# Altium schematic sheet Connectors.SchDoc: Connectors
size A4; DrawnBy: Jarod Krane; Organization: Altium Limited; Address1: L3, 12a Rodborough Rd; Address2: Frenchs Forest; Address3: NSW; Address4: Australia 2086; Revision: 0; SheetNumber: 8; SheetTotal: 11
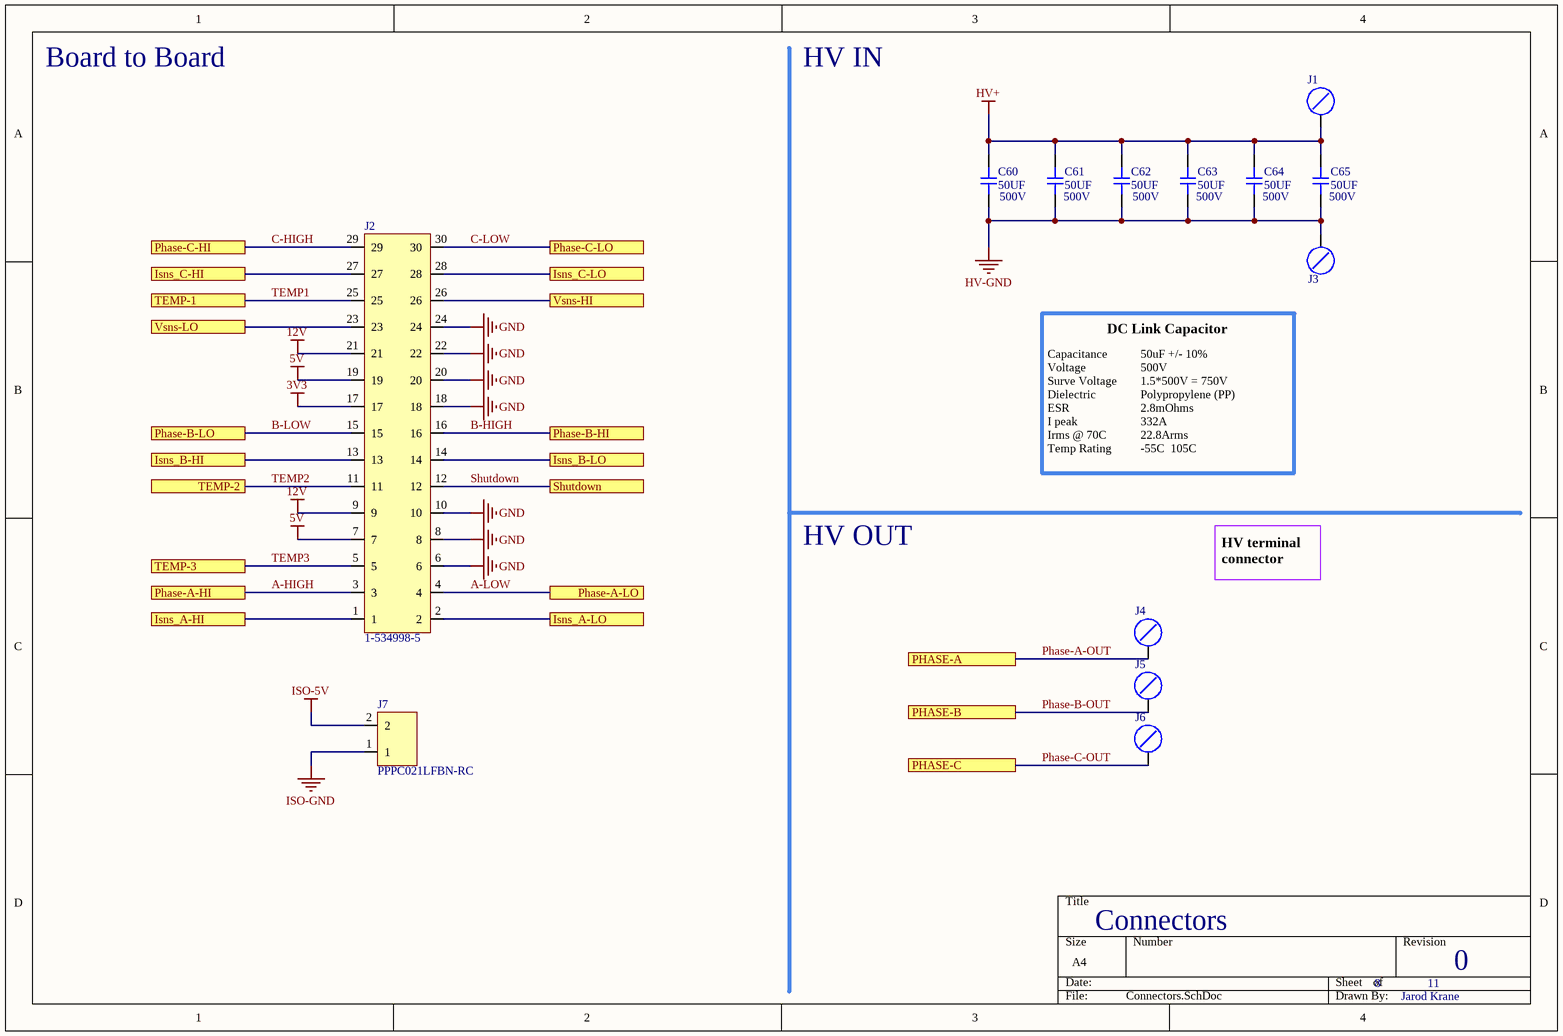
[diagram p0: Connectors.SchDoc]

## Parts
C60  50UF  Voltage Rating (DC): 500V  [DCLINKCAP]
C61  50UF  Voltage Rating (DC): 500V  [DCLINKCAP]
C62  50UF  Voltage Rating (DC): 500V  [DCLINKCAP]
C63  50UF  Voltage Rating (DC): 500V  [DCLINKCAP]
C64  50UF  Voltage Rating (DC): 500V  [DCLINKCAP]
C65  50UF  Voltage Rating (DC): 500V  [DCLINKCAP]
J1  M8 Terminal  [M8 Terminal]  (value not drawn)
J2  1-534998-5  [CONN POS-F]
J3  M8 Terminal  [M8 Terminal]  (value not drawn)
J4  M8 Terminal  [M8 Terminal]  (value not drawn)
J5  M8 Terminal  [M8 Terminal]  (value not drawn)
J6  M8 Terminal  [M8 Terminal]  (value not drawn)
J7  PPPC021LFBN-RC  [CONN-2POS-F]

## Ports
Isns_A-HI, Isns_A-LO, Isns_B-HI, Isns_B-LO, Isns_C-HI, Isns_C-LO, PHASE-A, Phase-A-HI, Phase-A-LO, PHASE-B, Phase-B-HI, Phase-B-LO, PHASE-C, Phase-C-HI, Phase-C-LO, Shutdown, TEMP-1, TEMP-2, TEMP-3, Vsns-HI, Vsns-LO

## Nets
3V3: J2.17
5V: J2.7 J2.19
12V: J2.9 J2.21
GND: J2.6 J2.8 J2.10 J2.18 J2.20 J2.22 J2.24
HV+: C60.2 C61.2 C62.2 C63.2 C64.2 C65.2 J1.1
HV-GND: C60.1 C61.1 C62.1 C63.1 C64.1 C65.1 J3.1
ISO-5V: J7.2
ISO-GND: J7.1
A-HIGH: J2.3 ; port Phase-A-HI
A-LOW: J2.4 ; port Phase-A-LO
B-HIGH: J2.16 ; port Phase-B-HI
B-LOW: J2.15 ; port Phase-B-LO
C-HIGH: J2.29 ; port Phase-C-HI
C-LOW: J2.30 ; port Phase-C-LO
Isns_A-HI: J2.1 ; port Isns_A-HI
Isns_A-LO: J2.2 ; port Isns_A-LO
Isns_B-HI: J2.13 ; port Isns_B-HI
Isns_B-LO: J2.14 ; port Isns_B-LO
Isns_C-HI: J2.27 ; port Isns_C-HI
Isns_C-LO: J2.28 ; port Isns_C-LO
Phase-A-OUT: J4.1 ; port PHASE-A
Phase-B-OUT: J5.1 ; port PHASE-B
Phase-C-OUT: J6.1 ; port PHASE-C
Shutdown: J2.12 ; port Shutdown
TEMP1: J2.25 ; port TEMP-1
TEMP2: J2.11 ; port TEMP-2
TEMP3: J2.5 ; port TEMP-3
Vsns-HI: J2.26 ; port Vsns-HI
Vsns-LO: J2.23 ; port Vsns-LO

## Notes on the sheet
- Board to Board
- HV IN
- DC Link Capacitor
- Capacitance
  Voltage
  Surve Voltage
  Dielectric
  ESR
  I peak
  Irms @ 70C
  Temp Rating
- 50uF +/- 10%
  500V
  1.5*500V = 750V
  Polypropylene (PP)
  2.8mOhms
  332A
  22.8Arms
  -55C  105C
- HV OUT
- HV terminal connector
- Title
- Size:
- Date:
- B
- Number:
- Time:
- Revision:
- Sheet
- of
- File:

## Library data of the parts
C60-C65 = 50UF-500V: CAP FILM 50UF 10% 500VDC RADIAL; Manufacturer: KEMET; Manufacturer Part Number: C4AQLBW5500A3JK; Dielectric Material: PP; ESR (Equivalent Series Resistance): 2.8mR; Supplier 1: Digi-Key; Stock 1: 0; Mount: Through Hole; Case/Package: Radial; Min Operating Temperature: -40°C; Max Operating Temperature: 105°C; Packaging: Bulk; Capacitance: 50uF; Tolerance: 10%; Termination: PC Pins; Ratings: AEC-Q200; RoHS Compliant: Yes; ComponentLink1URL: http://www.farnell.com/datasheets/2754776.pdf?src-supplier=Farnell; ComponentLink1Description: http://www.farnell.com/datasheets/2754776.pdf?src-supplier=Farnell; ComponentLink2URL: http://www.farnell.com/datasheets/2754776.pdf?src-supplier=Element14; ComponentLink2Description: http://www.farnell.com/datasheets/2754776.pdf?src-supplier=Element14; ComponentLink3URL: https://media.digikey.com/pdf/Data%20Sheets/Kemet%20PDFs/C4AQ%20Series,%20Auto.pdf?src-supplier=Digi-Key; ComponentLink3Description: https://media.digikey.com/pdf/Data%20Sheets/Kemet%20PDFs/C4AQ%20Series,%20Auto.pdf?src-supplier=Digi-Key; ComponentLink4URL: http://www.farnell.com/datasheets/2754776.pdf?src-supplier=Newark; ComponentLink4Description: http://www.farnell.com/datasheets/2754776.pdf?src-supplier=Newark; Supplier Part Number 1: 399-17001-ND
J1 J3-J6 = M8 Terminal: M8 Screw terminal for HV connections
J2 = CONN-30POS-F: 30 Position Receptacle Connector 0.100" (2.54mm) Through Hole Gold; Manufacturer: TE Connectivity; Number of Positions: 30; Connector Type: Receptacle,Connector,Socket; PCB Mount Retention: Without; PCB Mounting Orientation: Vertical; Contact Current Rating: 2A; Insulation Resistance: 5GR; Contact Resistance: 12MR; Gender: Female; Boss: No (Without); High Temperature Compatible: No; Stackable: Yes; Voltage Rating: 250V; Row Spacing: 0.1inch; PCB Thickness: 1.57mm; Contact Post Length: 0.125inch; Plating Thickness: 7.61um; Tail Length: 3.18mm; Approvals: CSA; Supplier 1: Digi-Key; Manufacturer Part Number: 1-534998-5; Stock 1: 870; Pricing 1: 1=4.73, 10=4.536, 100=3.78, 500=3.213, 1000=2.7405, 5000=2.457 (USD); Mount: Through Hole; Contact Plating: Gold,Tin,Lead; Color: Black; Contact Material: Bronze; Housing Color: Black; Housing Material: Thermoplastic; Contact Shape: Round; Min Operating Temperature: -65°C; Max Operating Temperature: 125°C; Number of Rows: 2; Package Quantity: 15; Packaging: Rail/Tube; Termination: Solder; Number of Contacts: 30; Series: AMPMODU MOD IV; Contact Type: Female Socket; Orientation: Straight; Current Rating: 2A; Sealable: No (Without); Length: 38.1mm; Height: 5.03mm; Pitch: 2.54mm; Contact Mating Length: 3.77mm; Depth: 5.03mm; Radiation Hardening: No; Lead Free: Contains Lead; ELV: Non-Compliant; Flammability Rating: UL94 V-0; ComponentLink1URL: http://www.te.com/commerce/DocumentDelivery/DDEController?Action=srchrtrv&DocNm=1307819_AMPMODU&DocType=DS&DocLang=English&s_cid=1046&src-supplier=Avnet; ComponentLink1Description: http://www.te.com/commerce/DocumentDelivery/DDEController?Action=srchrtrv&DocNm=1307819_AMPMODU&DocType=DS&DocLang=English&s_cid=1046&src-supplier=Avnet; ComponentLink2URL: http://www.onlinecomponents.com/productFiles/mf-AMP/eng_cat_1307819_0306_084_222_.pdf?src-supplier=Onlinecomponents.com; ComponentLink2Description: http://www.onlinecomponents.com/productFiles/mf-AMP/eng_cat_1307819_0306_084_222_.pdf?src-supplier=Onlinecomponents.com; ComponentLink3URL: https://www.te.com/commerce/DocumentDelivery/DDEController?Action=srchrtrv&DocNm=534998&DocType=Customer+Drawing&DocLang=English&src-supplier=Digi-Key; ComponentLink3Description: https://www.te.com/commerce/DocumentDelivery/DDEController?Action=srchrtrv&DocNm=534998&DocType=Customer+Drawing&DocLang=English&src-supplier=Digi-Key; Supplier Part Number 1: A26494-ND
J7 = CONN-2POS-F: CONN HDR 2POS 0.1 GOLD PCB; Manufacturer: Sullins; Number of Positions: 2; Connector Type: Header; Pitch: 0.1inch; Supplier 1: Digi-Key; Manufacturer Part Number: PPPC021LFBN-RC; Stock 1: 17824; Pricing 1: 1=0.33, 10=0.315, 100=0.2205, 500=0.189, 1000=0.1575, 5000=0.135, 10000=0.126 (USD); Mount: Through Hole; Color: Black; Contact Plating: Gold; Contact Material: Bronze; Housing Material: Plastic; Package Quantity: 1000; Number of Rows: 1; Packaging: Bulk; Termination: Solder; Contact Type: Female Socket; Length: 5.58mm; Width: 2.5mm; Height: 8.5mm; Lead Free: Lead Free; RoHS Compliant: Yes; Supplier Part Number 1: S7035-ND